# EasyEDA Pro project ProPrj_MiniFoc_AT32F403A.epro, board PCB
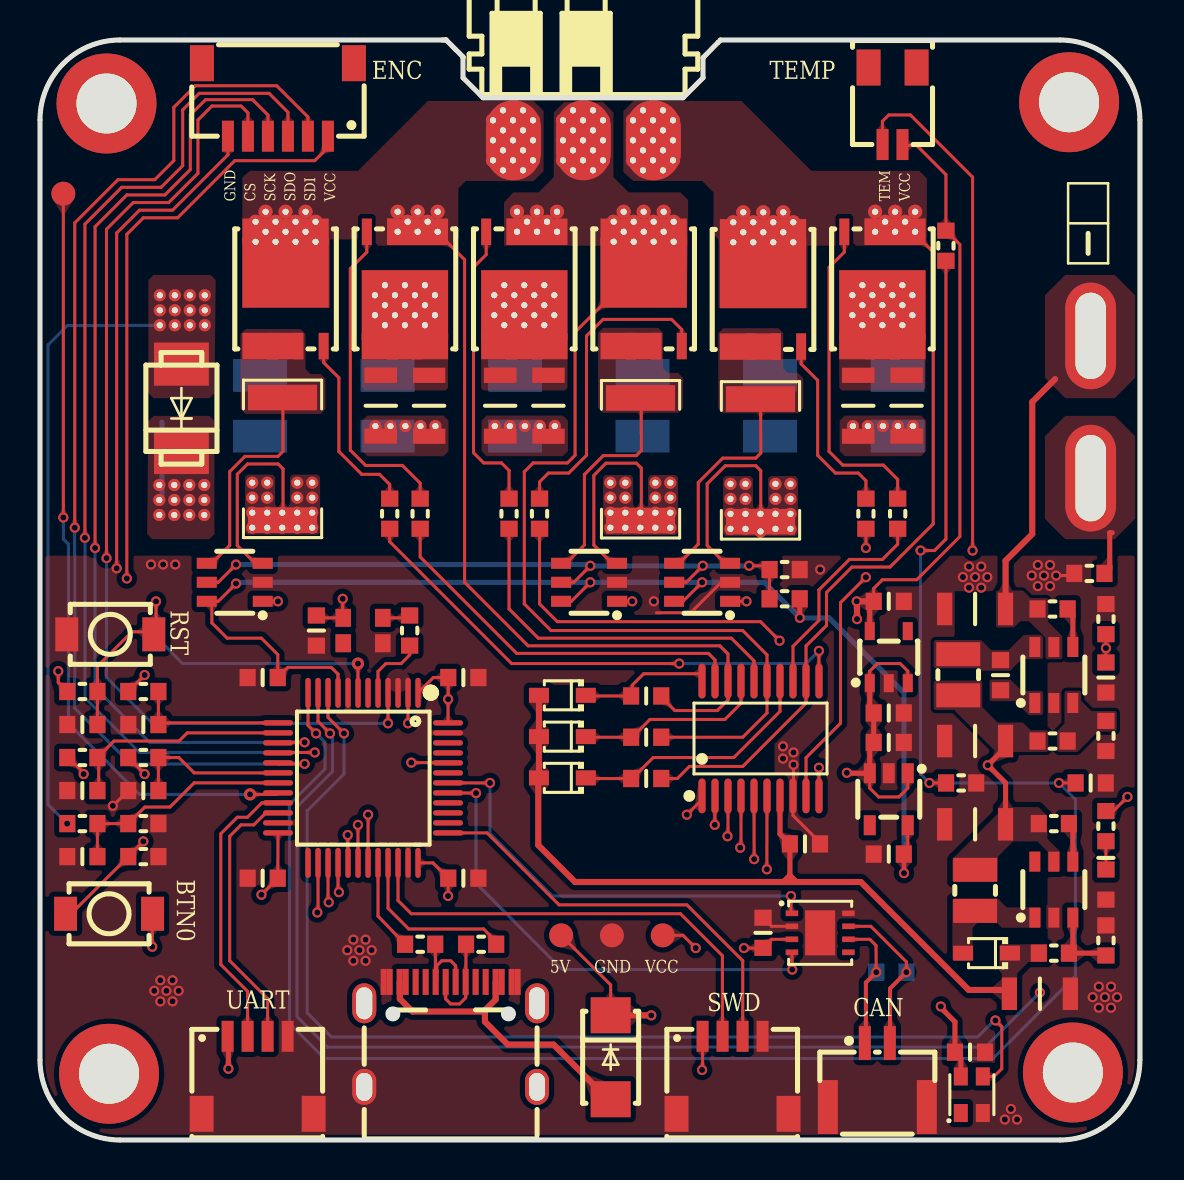
[diagram p3: board, top side]
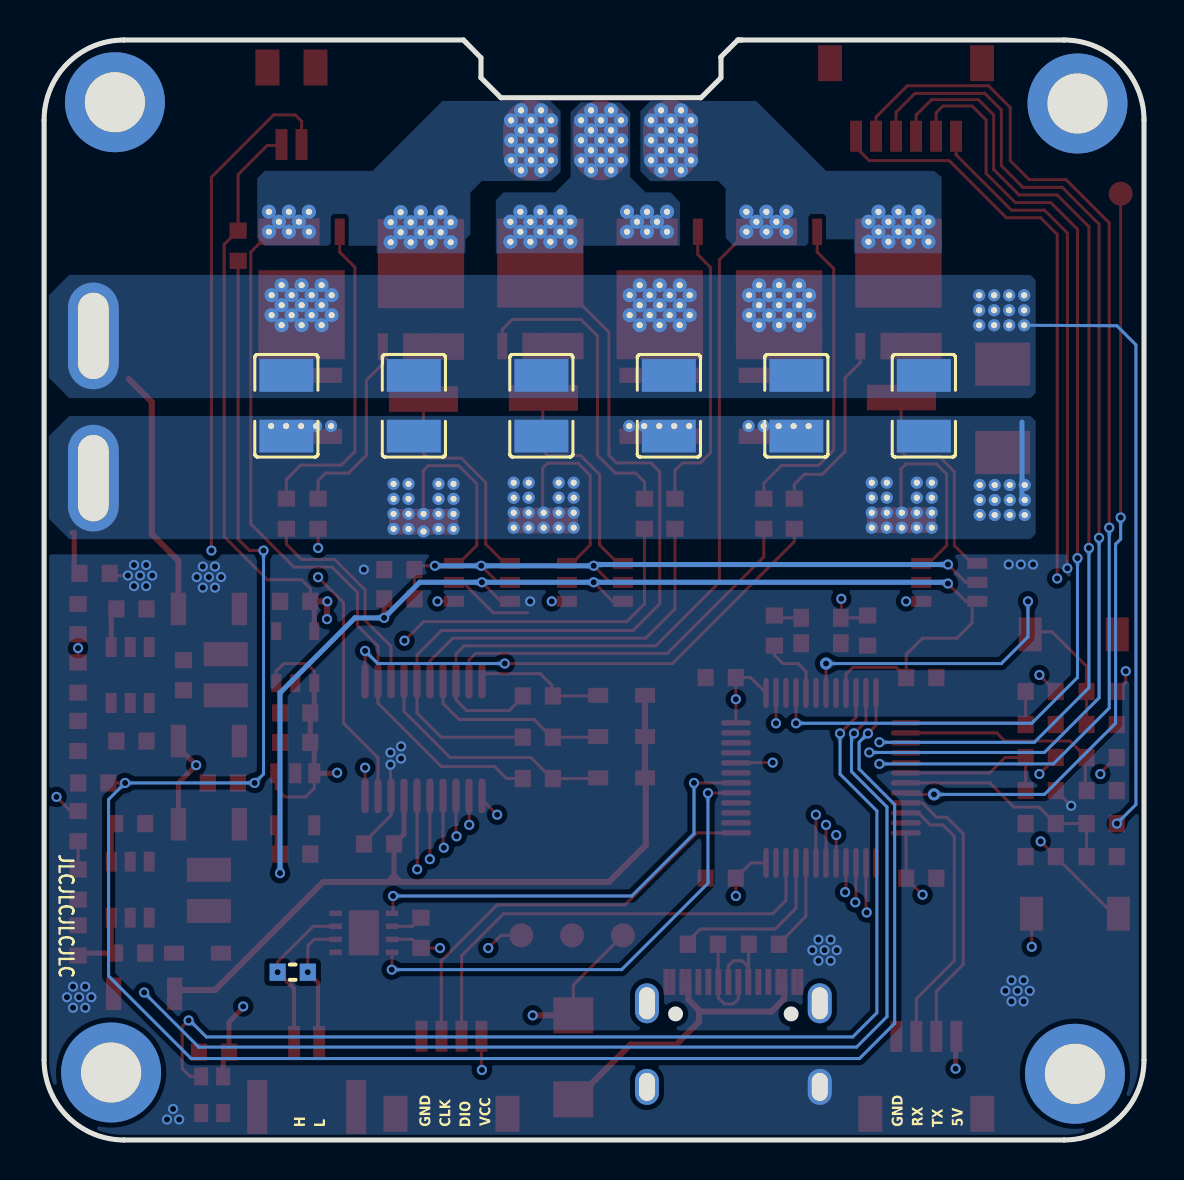
[diagram p4: board, bottom side, seen from below]

Outline 55 x 55 mm; copper layers: Top Layer, Inner1, Inner2, Bottom Layer. Coordinates in mm from the lower left corner of the outline.
Outline path: 20.31,55 4,55 arc(1.17,53.83) 0,51 0,4 arc(1.17,1.17) 4,0 51,0 arc(53.83,1.17) 55,4 55,51 arc(53.83,53.83) 51,55 34.03,55 33.9,54.88 33.16,54.11 33.16,53.11 32.15,52.11 22.15,52.11 21.15,53.11 21.15,54.15 20.31,55 ; 20.31,55 20.1,55
Stack: Top Layer 0.035mm / Dielectric1 0.48mm PP er 4.5 / Inner1 0.035mm / Dielectric2 0.48mm FR4 er 4.5 / Inner2 0.035mm / Dielectric3 0.48mm PP er 4.5 / Bottom Layer 0.035mm

## Design rules (mm)
spacing Default (default): track to track 0.114, other pairs 0 to 0.114
track width Default (default): min 0.152, default 0.152, max 25.4
differential pair differentialPair (default): width min 0.127, default 0.254, max 2.54; gap min 0.152, default 0.152
via Default (default): diameter min 0.508, default 0.508, max 100.025; hole min 0.305, default 0.305, max 59.995
net VCC uses gge95022
net GND uses gge532927
net DCBUS uses gge95022(2)
net 5V uses gge95022
net $1N272 uses gge95022
net $1N238 uses gge95022
net $1N239 uses gge95022
net VGS uses gge95022
net $1N13637 uses gge95022
pour e628 uses gge95022
pour e629 uses gge95022(1)
pour e630 uses gge95022(2)
pour e2292 uses gge95022

## Placement (name value [footprint] x y rotation side)
C1  100nF  [C0603_SMALL]  11.14 13.09 0 top
C2  10uF  [C0603_SMALL]  38.25 14.8 0 top
C3  1uF  [C0603_SMALL]  30.31 18.07 180 top
C4  22uF  [C1206_SMALL]  50 7.31 180 top
C5  22uF  [C1206_SMALL]  46.76 15.78 0 top
C6  100nF  [C0603_SMALL]  48.03 23.24 270 top
C7  2.2uF  [C0603_SMALL]  53.3 23.12 90 top
C8  10uF  [C1206_SMALL]  23.01 36.71 90 top
C9  1uF  [C0603_SMALL]  2.12 14.17 0 top
C10  100nF  [C0603_SMALL]  46.51 4.39 0 top
C11  1uF  [C0603_SMALL]  30.31 22.2 180 top
C12  1uF  [C0603_SMALL]  30.31 20.14 180 top
C13  100nF  [C0603_SMALL]  2.12 20.77 0 top
C14  100nF  [C0603_SMALL]  36.16 10.36 270 top
C17  100nF  [C0603_SMALL]  21.17 13.09 180 top
C18  100nF  [C0603_SMALL]  21.17 23.12 180 top
C19  100nF  [C0603_SMALL]  13.82 25.47 90 top
C20  47uF  [C1206_SMALL]  46.76 19.95 0 top
C21  10uF  [C1206_SMALL]  25.42 36.71 90 top
C22  1nF  [C0603_SMALL]  5.17 20.77 180 top
C23  1nF  [C0603_SMALL]  2.12 17.47 180 top
C24  1nF  [C0603_SMALL]  5.17 17.47 180 top
C25  10uF  [C1206_SMALL]  40.92 36.71 90 top
C26  10uF  [C1206_SMALL]  43.33 36.71 90 top
C27  4.7uF  [C1206_SMALL]  46.76 26.55 0 top
C28  10uF  [C1206_SMALL]  17.04 36.71 90 top
C29  10uF  [C1206_SMALL]  19.45 36.71 90 top
C30  1uF  [C0603_SMALL]  42.44 14.3 0 top
C31  1uF  [C0603_SMALL]  42.44 19.88 180 top
C32  100nF  [C0603_SMALL]  11.14 23.12 180 top
C46  2.2uF  [C0603_SMALL]  52.54 17.85 180 top
C89  10uF  [C0603_SMALL]  42.44 21.35 180 top
C90  10uF  [C0603_SMALL]  42.44 26.93 180 top
CN1  M1010RS-04P  [CONN-SMD_M1010RS-04P]  10.88 3.25 0 top
CN4  M1010RS-04P  [CONN-SMD_M1010RS-04P]  34.63 3.25 0 top
CN5  M1010RS-06P  [CONN-SMD_M1010RS-06P]  11.9 52.02 0 top
CN6  A1002WR-S-2P  [CONN-SMD_A1002WR-S-2P]  42.63 51.7 180 top
CN7  X1251WRS-02HF-LPSW  [CONN-SMD_2P-P1.25_X1251WRS-02HF-LPSW]  41.87 3.25 0 top
D1  SMBJ36CA  [SMB(DO-214AA)]  7.07 36.58 270 top
D2  1N5819WS  [SOD-323_L1.8-W1.3-LS2.5-RD]  26.12 20.17 180 top
D3  1N5819WS  [SOD-323_L1.8-W1.3-LS2.5-RD]  26.12 22.23 180 top
D4  SS34  [SMA_L4.4-W2.8-LS5.4-RD]  28.53 4.14 270 top
D5  1N5819WS  [SOD-323_L1.8-W1.3-LS2.5-RD]  26.12 18.11 180 top
D6  1N5819WS  [SOD-323_L1.8-W1.3-LS2.5-RD]  47.33 9.34 180 top
H1  -  [MR30-M]  27.18 49.98 0 top
L1  10uH  [IND-SMD_L2.5-W2.0]  46.76 12.48 90 top
L2  4.7uH  [IND-SMD_L2.5-W2.0]  45.92 23.26 90 top
LED2  NCD0603B1  [LED0603_RED_SMALL]  53.3 12.77 270 top
LED4  WS2812B-2020  [LED-SMD_4P-L2.0-W2.0-TL_WS2812B-2020]  46.6 2.26 90 top
MC1  22uF  [C1210]  42.89 36.71 90 bottom
MC2  22uF  [C1210]  36.51 36.71 90 bottom
MC3  22uF  [C1210]  30.13 36.71 90 bottom
MC4  22uF  [C1210]  11.01 36.71 90 bottom
MC5  22uF  [C1210]  17.38 36.71 90 bottom
MC6  22uF  [C1210]  23.76 36.71 90 bottom
NOREF  -  [Pad_e1771]  29.65 48.98 90 top
NOREF#2  -  [Pad_e1831]  3.33 51.83 180 top
NOREF#3  -  [Pad_e1722]  12.11 30.62 0 top
NOREF#4  -  [Pad_e1760]  36.78 32.81 0 top
NOREF#5  -  [Pad_e1729]  12.86 31.37 0 top
NOREF#6  -  [Pad_e1736]  28.52 31.37 0 top
NOREF#7  -  [Pad_e1724]  12.86 32.87 0 top
NOREF#8  -  [Pad_e1758]  36.03 30.43 0 top
NOREF#9  -  [Pad_e1739]  29.27 30.62 0 top
NOREF#10  -  [Pad_e1904]  31.19 45.41 0 top
NOREF#11  -  [Pad_e1816]  24.15 49.48 90 top
NOREF#12  -  [Pad_e1846]  41.62 41.24 0 top
NOREF#13  -  [Pad_e1795]  27.65 51.48 90 top
NOREF#14  -  [Pad_e1796]  28.15 50.98 90 top
NOREF#15  -  [Pad_e1726]  12.86 32.12 0 top
NOREF#16  -  [Pad_e1962]  5.99 41.49 180 top
NOREF#17  -  [Pad_e1756]  34.53 30.56 0 top
NOREF#18  -  [Pad_e1713]  52.54 33.09 0 top
NOREF#19  -  [Pad_e1898]  10.78 45.91 0 top
NOREF#20  -  [Pad_e1906]  31.19 46.41 0 top
NOREF#21  -  [Pad_e1734]  28.52 32.12 0 top
NOREF#22  -  [Pad_e1811]  23.65 50.98 90 top
NOREF#23  -  [Pad_e1950]  18.88 46.41 0 top
NOREF#24  -  [Pad_e1947]  18.38 45.91 0 top
NOREF#25  -  [Pad_e1723]  12.11 31.37 0 top
NOREF#26  -  [Pad_e1959]  6.74 40.74 180 top
NOREF#27  -  [Pad_e1818]  24.15 48.48 90 top
NOREF#28  -  [Pad_e1789]  26.15 48.98 90 top
NOREF#29  -  [Pad_e1822]  8.22 32.75 0 top
NOREF#30  -  [Pad_e1826]  5.97 32 0 top
NOREF#31  -  [Pad_e1937]  25.35 45.91 0 top
NOREF#32  -  [Pad_e1842]  42.12 41.74 0 top
NOREF#33  -  [Pad_e1924]  34.67 45.89 0 top
NOREF#34  -  [Pad_e1836]  43.62 42.24 0 top
NOREF#35  -  [Pad_e1839]  43.12 40.74 0 top
NOREF#36  -  [Pad_e1944]  19.88 45.41 0 top
NOREF#37  -  [Pad_e1804]  23.15 50.48 90 top
NOREF#38  -  [Pad_e1772]  30.15 48.48 90 top
NOREF#39  -  [Pad_e1983]  42.9 35.7 0 top
NOREF#40  -  [Pad_e1932]  41.76 45.41 0 top
NOREF#41  -  [Pad_e1979]  25.74 35.7 0 top
NOREF#42  -  [Pad_e1800]  28.15 48.98 90 top
NOREF#43  -  [Pad_e1871]  19.25 41.74 0 top
NOREF#44  -  [Pad_e1802]  23.15 51.48 90 top
NOREF#45  -  [Pad_e1862]  23.72 42.24 0 top
NOREF#46  -  [Pad_e1847]  41.12 40.74 0 top
NOREF#47  -  [Pad_e1860]  24.72 42.24 0 top
NOREF#48  -  [Pad_e1921]  35.67 44.89 0 top
NOREF#49  -  [Pad_e1764]  37.53 31.31 0 top
NOREF#50  -  [Pad_e1960]  6.74 41.49 180 top
NOREF#51  -  [Pad_e1887]  12.28 45.41 0 top
NOREF#52  -  [Pad_e1762]  36.78 32.06 0 top
NOREF#53  -  [Pad_e1918]  36.67 45.89 0 top
NOREF#54  -  [Pad_e1835]  43.12 42.74 0 top
NOREF#55  -  [Pad_e1725]  13.61 32.87 0 top
NOREF#56  -  [Pad_e1858]  24.22 40.74 0 top
NOREF#57  -  [Pad_e1883]  17.25 41.74 0 top
NOREF#58  -  [Pad_e1977]  24.24 35.7 0 top
NOREF#59  -  [Pad_e1856]  25.22 40.74 0 top
NOREF#60  -  [Pad_e1865]  22.72 41.24 0 top
NOREF#61  -  [Pad_e1917]  36.67 44.89 0 top
NOREF#62  -  [Pad_e1781]  31.65 49.98 90 top
NOREF#63  -  [Pad_e1896]  10.78 44.91 0 top
NOREF#64  -  [Pad_e1774]  30.15 50.48 90 top
NOREF#65  -  [Pad_e1894]  11.78 45.91 0 top
NOREF#66  -  [Pad_e1881]  17.25 40.74 0 top
NOREF#67  -  [Pad_e1840]  42.62 41.24 0 top
NOREF#68  -  [Pad_e1728]  13.61 31.37 0 top
NOREF#69  -  [Pad_e1759]  36.03 31.31 0 top
NOREF#70  -  [Pad_e1897]  11.28 45.41 0 top
NOREF#71  -  [Pad_e1926]  36.17 46.39 0 top
NOREF#72  -  [Pad_e1978]  24.99 35.7 0 top
NOREF#73  -  [Pad_e1940]  23.85 45.41 0 top
NOREF#74  -  [Pad_e1791]  26.65 48.48 90 top
NOREF#75  -  [Pad_e1735]  29.27 32.12 0 top
NOREF#76  -  [Pad_e1957]  7.49 40.74 180 top
NOREF#77  -  [Pad_e1984]  43.65 35.7 0 top
NOREF#78  -  [Pad_e1971]  17.52 35.7 0 top
NOREF#79  -  [Pad_e1909]  29.69 45.91 0 top
NOREF#80  -  [Pad_e1901]  30.69 44.91 0 top
NOREF#81  -  [Pad_e1877]  18.75 42.24 0 top
NOREF#82  -  [Pad_e1825]  6.72 32 0 top
NOREF#83  -  [Pad_e1785]  26.65 51.48 90 top
NOREF#84  -  [Pad_e1769]  29.65 50.98 90 top
NOREF#85  -  [Pad_e1820]  6.72 32.75 0 top
NOREF#86  -  [Pad_e1941]  23.85 46.41 0 top
NOREF#87  -  [Pad_e1845]  41.62 42.24 0 top
NOREF#88  -  [Pad_e1828]  6.72 31.25 0 top
NOREF#89  -  [Pad_e1880]  17.75 41.24 0 top
NOREF#90  -  [Pad_e1902]  29.69 44.91 0 top
NOREF#91  -  [Pad_e1838]  43.62 41.24 0 top
NOREF#92  -  [Pad_e1907]  30.69 45.91 0 top
NOREF#93  -  [Pad_e1905]  31.69 45.91 0 top
NOREF#94  -  [Pad_e1935]  43.76 46.41 0 top
NOREF#95  -  [Pad_e1766]  36.78 30.56 0 top
NOREF#96  -  [Pad_e1920]  35.67 45.89 0 top
NOREF#97  -  [Pad_e1888]  12.78 45.91 0 top
NOREF#98  -  [Pad_e1733]  29.27 32.87 0 top
NOREF#99  -  [Pad_e1973]  19.02 35.7 0 top
NOREF#100  -  [Pad_e1936]  25.85 45.41 0 top
NOREF#101  -  [Pad_e1908]  30.19 46.41 0 top
NOREF#102  -  [Pad_e1882]  16.75 41.24 0 top
NOREF#103  -  [Pad_e1916]  37.17 45.39 0 top
NOREF#104  -  [Pad_e1884]  16.75 42.24 0 top
NOREF#105  -  [Pad_e1793]  27.15 49.98 90 top
NOREF#106  -  [Pad_e1923]  35.17 45.39 0 top
NOREF#107  -  [Pad_e1869]  19.25 42.74 0 top
NOREF#108  -  [Pad_e1757]  35.28 30.56 0 top
NOREF#109  -  [Pad_e1827]  5.97 31.25 0 top
NOREF#110  -  [Pad_e1974]  19.77 35.7 0 top
NOREF#111  -  [Pad_e1803]  22.65 50.98 90 top
NOREF#112  -  [Pad_e1720]  10.61 30.62 0 top
NOREF#113  -  [Pad_e1761]  37.53 32.81 0 top
NOREF#114  -  [Pad_e1943]  25.85 46.41 0 top
NOREF#115  -  [Pad_e1850]  40.62 42.24 0 top
NOREF#116  -  [Pad_e1775]  30.65 50.98 90 top
NOREF#117  -  [Pad_e1779]  30.65 49.98 90 top
NOREF#118  -  [Pad_e1911]  28.69 44.91 0 top
NOREF#119  -  [Pad_e1810]  23.65 49.98 90 top
NOREF#120  -  [Pad_e1824]  7.47 32 0 top
NOREF#121  -  [Pad_e1930]  42.76 45.41 0 top
NOREF#122  -  [Pad_e1852]  25.22 42.74 0 top
NOREF#123  -  [Pad_e1813]  24.65 50.98 90 top
NOREF#124  -  [Pad_e1797]  27.65 50.48 90 top
NOREF#125  -  [Pad_e1891]  13.78 45.91 0 top
NOREF#126  -  [Pad_e1777]  31.65 50.98 90 top
NOREF#127  -  [Pad_e1814]  24.15 50.48 90 top
NOREF#128  -  [Pad_e1752]  34.53 32.06 0 top
NOREF#129  -  [Pad_e1750]  34.53 32.81 0 top
NOREF#130  -  [Pad_e1929]  43.26 45.91 0 top
NOREF#131  -  [Pad_e1821]  7.47 32.75 0 top
NOREF#132  -  [Pad_e1900]  31.69 44.91 0 top
NOREF#133  -  [Pad_e1837]  43.12 41.74 0 top
NOREF#134  -  [Pad_e1754]  34.53 31.31 0 top
NOREF#135  -  [Pad_e1819]  5.97 32.75 0 top
NOREF#136  -  [Pad_e1859]  24.22 41.74 0 top
NOREF#137  -  [Pad_e1854]  25.22 41.74 0 top
NOREF#138  -  [Pad_e1716]  10.61 32.12 0 top
NOREF#139  -  [Pad_e1861]  24.22 42.74 0 top
NOREF#140  -  [Pad_e1753]  35.28 32.06 0 top
NOREF#141  -  [Pad_e1878]  18.25 42.74 0 top
NOREF#142  -  [Pad_e1798]  28.15 49.98 90 top
NOREF#143  -  [Pad_e1915]  37.67 45.89 0 top
NOREF#144  -  [Pad_e1730]  12.86 30.62 0 top
NOREF#145  -  [Pad_e1876]  18.25 41.74 0 top
NOREF#146  -  [Pad_e1794]  27.15 50.98 90 top
NOREF#147  -  [Pad_e1954]  8.24 42.24 180 top
NOREF#148  -  [Pad_e1833]  3.45 3.31 180 top
NOREF#149  -  [Pad_e1922]  34.67 44.89 0 top
NOREF#150  -  [Pad_e1925]  35.17 46.39 0 top
NOREF#151  -  [Pad_e1767]  37.53 30.56 0 top
NOREF#152  -  [Pad_e1801]  27.65 48.48 90 top
NOREF#153  -  [Pad_e1829]  7.47 31.25 0 top
NOREF#154  -  [Pad_e1874]  18.75 41.24 0 top
NOREF#155  -  [Pad_e1857]  24.72 41.24 0 top
NOREF#156  -  [Pad_e1782]  31.65 48.98 90 top
NOREF#157  -  [Pad_e1747]  30.77 31.37 0 top
NOREF#158  -  [Pad_e1864]  23.22 40.74 0 top
NOREF#159  -  [Pad_e1863]  23.72 41.24 0 top
NOREF#160  -  [Pad_e1952]  6.74 42.24 180 top
NOREF#161  -  [Pad_e1745]  31.52 32.12 0 top
NOREF#162  -  [Pad_e1807]  23.15 49.48 90 top
NOREF#163  -  [Pad_e1834]  51.65 3.37 180 top
NOREF#164  -  [Pad_e1949]  17.88 46.41 0 top
NOREF#165  -  [Pad_e1955]  8.24 41.49 180 top
NOREF#166  -  [Pad_e1879]  17.75 42.24 0 top
NOREF#167  -  [Pad_e1815]  24.65 49.98 90 top
NOREF#168  -  [Pad_e1778]  31.15 50.48 90 top
NOREF#169  -  [Pad_e1799]  27.65 49.48 90 top
NOREF#170  -  [Pad_e1948]  17.88 45.41 0 top
NOREF#171  -  [Pad_e1742]  30.77 32.87 0 top
NOREF#172  -  [Pad_e1786]  26.15 50.98 90 top
NOREF#173  -  [Pad_e1776]  31.15 51.48 90 top
NOREF#174  -  [Pad_e1866]  23.22 41.74 0 top
NOREF#175  -  [Pad_e1946]  18.88 45.41 0 top
NOREF#176  -  [Pad_e1741]  30.02 31.37 0 top
NOREF#177  -  [Pad_e1912]  28.69 45.91 0 top
NOREF#178  -  [Pad_e1783]  31.15 48.48 90 top
NOREF#179  -  [Pad_e1749]  31.52 30.62 0 top
NOREF#180  -  [Pad_e1790]  26.65 49.48 90 top
NOREF#181  -  [Pad_e1727]  13.61 32.12 0 top
NOREF#182  -  [Pad_e1746]  31.52 31.37 0 top
NOREF#183  -  [Pad_e1958]  7.49 41.49 180 top
NOREF#184  -  [Pad_e1792]  27.15 48.98 90 top
NOREF#185  -  [Pad_e1843]  42.62 42.24 0 top
NOREF#186  -  [Pad_e1812]  24.15 51.48 90 top
NOREF#187  -  [Pad_e1867]  22.72 42.24 0 top
NOREF#188  -  [Pad_e1763]  37.53 32.06 0 top
NOREF#189  -  [Pad_e1942]  24.85 46.41 0 top
NOREF#190  -  [Pad_e1784]  30.65 48.98 90 top
NOREF#191  -  [Pad_e1953]  7.49 42.24 180 top
NOREF#192  -  [Pad_e1740]  30.02 30.62 0 top
NOREF#193  -  [Pad_e1945]  19.38 45.91 0 top
NOREF#194  -  [Pad_e1805]  22.65 49.98 90 top
NOREF#195  -  [Pad_e1961]  5.99 40.74 180 top
NOREF#196  -  [Pad_e1927]  37.17 46.39 0 top
NOREF#197  -  [Pad_e1890]  13.78 44.91 0 top
NOREF#198  -  [Pad_e1848]  40.62 41.24 0 top
NOREF#199  -  [Pad_e1773]  30.15 49.48 90 top
NOREF#200  -  [Pad_e1895]  11.78 44.91 0 top
NOREF#201  -  [Pad_e1934]  42.76 46.41 0 top
NOREF#202  -  [Pad_e1931]  42.26 45.91 0 top
NOREF#203  -  [Pad_e1982]  42.15 35.7 0 top
NOREF#204  -  [Pad_e1849]  41.12 41.74 0 top
NOREF#205  -  [Pad_e1913]  29.19 46.41 0 top
NOREF#206  -  [Pad_e1770]  29.65 49.98 90 top
NOREF#207  -  [Pad_e1980]  40.65 35.7 0 top
NOREF#208  -  [Pad_e1872]  19.75 41.24 0 top
NOREF#209  -  [Pad_e1933]  41.76 46.41 0 top
NOREF#210  -  [Pad_e1719]  11.36 31.37 0 top
NOREF#211  -  [Pad_e1981]  41.4 35.7 0 top
NOREF#212  -  [Pad_e1718]  10.61 31.37 0 top
NOREF#213  -  [Pad_e1744]  30.77 32.12 0 top
NOREF#214  -  [Pad_e1951]  19.88 46.41 0 top
NOREF#215  -  [Pad_e1873]  19.25 40.74 0 top
NOREF#216  -  [Pad_e1892]  13.28 46.41 0 top
NOREF#217  -  [Pad_e1851]  41.12 42.74 0 top
NOREF#218  -  [Pad_e1732]  28.52 32.87 0 top
NOREF#219  -  [Pad_e1868]  23.22 42.74 0 top
NOREF#220  -  [Pad_e1817]  24.65 48.98 90 top
NOREF#221  -  [Pad_e1886]  12.78 44.91 0 top
NOREF#222  -  [Pad_e1899]  11.28 46.41 0 top
NOREF#223  -  [Pad_e1808]  23.15 48.48 90 top
NOREF#224  -  [Pad_e1844]  42.12 42.74 0 top
NOREF#225  -  [Pad_e1755]  35.28 31.31 0 top
NOREF#226  -  [Pad_e1823]  8.22 32 0 top
NOREF#227  -  [Pad_e1788]  26.15 49.98 90 top
NOREF#228  -  [Pad_e1721]  11.36 30.62 0 top
NOREF#229  -  [Pad_e1806]  22.65 48.98 90 top
NOREF#230  -  [Pad_e1765]  36.78 31.31 0 top
NOREF#231  -  [Pad_e1748]  30.77 30.62 0 top
NOREF#232  -  [Pad_e1885]  17.25 42.74 0 top
NOREF#233  -  [Pad_e1717]  11.36 32.12 0 top
NOREF#234  -  [Pad_e1743]  31.52 32.87 0 top
NOREF#235  -  [Pad_e1914]  37.67 44.89 0 top
NOREF#236  -  [Pad_e1889]  13.28 45.41 0 top
NOREF#237  -  [Pad_e1738]  28.52 30.62 0 top
NOREF#238  -  [Pad_e1714]  10.61 32.87 0 top
NOREF#239  -  [Pad_e1919]  36.17 45.39 0 top
NOREF#240  -  [Pad_e1780]  31.15 49.48 90 top
NOREF#241  -  [Pad_e1809]  23.65 48.98 90 top
NOREF#242  -  [Pad_e1870]  19.75 42.24 0 top
NOREF#243  -  [Pad_e1976]  23.49 35.7 0 top
NOREF#244  -  [Pad_e1715]  11.36 32.87 0 top
NOREF#245  -  [Pad_e1991]  52.54 40.2 0 top
NOREF#246  -  [Pad_e1972]  18.27 35.7 0 top
NOREF#247  -  [Pad_e1737]  29.27 31.37 0 top
NOREF#248  -  [Pad_e1855]  25.72 41.24 0 top
NOREF#249  -  [Pad_e1830]  8.22 31.25 0 top
NOREF#250  -  [Pad_e1970]  16.77 35.7 0 top
NOREF#251  -  [Pad_e1731]  13.61 30.62 0 top
NOREF#252  -  [Pad_e1841]  42.12 40.74 0 top
NOREF#253  -  [Pad_e1832]  51.46 51.89 180 top
NOREF#254  -  [Pad_e1939]  24.35 45.91 0 top
NOREF#255  -  [Pad_e1875]  18.25 40.74 0 top
NOREF#256  -  [Pad_e1903]  30.19 45.41 0 top
NOREF#257  -  [Pad_e1910]  29.19 45.41 0 top
NOREF#258  -  [Pad_e1893]  12.28 46.41 0 top
NOREF#259  -  [Pad_e1928]  43.76 45.41 0 top
NOREF#260  -  [Pad_e1975]  22.74 35.7 0 top
NOREF#261  -  [Pad_e1853]  25.72 42.24 0 top
NOREF#262  -  [Pad_e1938]  24.85 45.41 0 top
NOREF#263  -  [Pad_e1768]  30.15 51.48 90 top
NOREF#264  -  [Pad_e1751]  35.28 32.81 0 top
NOREF#265  -  [Pad_e1963]  5.99 42.24 180 top
NOREF#266  -  [Pad_e1787]  26.65 50.48 90 top
NOREF#267  -  [Pad_e1956]  8.24 40.74 180 top
Q7  KNY3406C  [PDFNWB-8L_L6.0-W5.0-P1.27-BL-EP_CON]  42.12 42.55 180 top
Q8  KNY3406C  [PDFNWB-8L_L6.0-W5.0-P1.27-BL-EP_CON]  24.22 42.55 180 top
Q9  KNY3406C  [PDFNWB-8L_L6.0-W5.0-P1.27-BL-EP_CON]  18.25 42.55 180 top
Q10  KNY3406C  [PDFNWB-8L_L6.0-W5.0-P1.27-BL-EP_CON]  36.16 42.53 0 top
Q11  KNY3406C  [PDFNWB-8L_L6.0-W5.0-P1.27-BL-EP_CON]  30.19 42.55 0 top
Q12  KNY3406C  [PDFNWB-8L_L6.0-W5.0-P1.27-BL-EP_CON]  12.28 42.55 0 top
R1  10kΩ  [R0603_SMALL]  2.12 15.82 0 top
R2  5mΩ  [R2512]  12.13 34.06 90 top
R3  5mΩ  [R2512]  30.03 34.04 90 top
R4  10kΩ  [R0603_SMALL]  2.12 22.42 0 top
R5  100kΩ  [R0603_SMALL]  50.7 9.34 0 top
R6  1kΩ  [R0603_SMALL]  53.3 15.69 270 top
R7  2.2Ω  [R0603_SMALL]  42.89 31.31 90 top
R8  1kΩ  [R0603_SMALL]  5.17 15.82 0 top
R9  120Ω  [R0603_SMALL]  42.57 8.39 180 bottom
R10  10kΩ  [R0603_SMALL]  5.17 14.17 0 top
R11  2.2Ω  [R0603_SMALL]  41.3 31.31 90 top
R12  22Ω  [R0603_SMALL]  18.48 25.47 90 top
R13  3.3kΩ  [R0603_SMALL]  46.06 17.85 0 top
R14  5mΩ  [R2512]  36.03 33.98 90 top
R15  3.3kΩ  [R0603_SMALL]  53.3 26.04 90 top
R16  22Ω  [R0603_SMALL]  5.17 22.42 180 top
R17  22Ω  [R0603_SMALL]  2.12 19.12 180 top
R18  22Ω  [R0603_SMALL]  5.17 19.12 180 top
R19  2.2Ω  [R0603_SMALL]  23.46 31.31 90 top
R20  1kΩ  [R0603_SMALL]  37.23 28.52 0 top
R21  1kΩ  [R0603_SMALL]  37.23 27.06 180 top
R22  2.2Ω  [R0603_SMALL]  24.98 31.31 90 top
R23  2.2Ω  [R0603_SMALL]  19.01 31.31 90 top
R24  2.2Ω  [R0603_SMALL]  17.49 31.31 90 top
R25  5.1kΩ  [R0603_SMALL]  53.3 9.98 90 top
R26  10kΩ  [R0603_SMALL]  53.3 20.2 270 top
R27  52.3kΩ  [R0603_SMALL]  50.63 19.95 0 top
R28  10kΩ  [R0603_SMALL]  50.7 15.82 0 top
R29  10kΩ  [R0603_SMALL]  50.63 26.55 0 top
R61  0Ω  [R0603_SMALL]  52.47 28.33 180 top
R62  22Ω  [R0603_SMALL]  22.06 9.79 180 top
R63  22Ω  [R0603_SMALL]  19.01 9.79 0 top
RT1  TCTR0603F10K0F3930T  [R0603_SMALL]  45.3 44.71 90 top
SW1  ST-1185S  [SW-SMD_ST-1185S]  3.52 25.28 0 top
SW2  ST-1185S  [SW-SMD_ST-1185S]  3.45 11.31 0 top
TP1  Testpoint 1.6mm  [TESTPOINT 1.6MM]  31.14 10.23 0 top
TP2  Testpoint 1.6mm  [TESTPOINT 1.6MM]  26.06 10.23 0 top
TP3  Testpoint 1.6mm  [TESTPOINT 1.6MM]  28.6 10.23 0 top
TP4  Testpoint 1.6mm  [TESTPOINT 1.6MM]  1.17 47.32 0 top
U1  FD6288T  [TSSOP-20_L6.5-W4.4-P0.65-LS6.4-BL]  36.03 20.08 0 top
U2  RY8411  [SOT-23-6_L2.9-W1.6-P0.95-LS2.8-BR]  50.7 23.25 270 top
U3  AT32F403ACGT7  [LQFP-48_L7.0-W7.0-P0.50-LS9.0-BL]  16.15 18.11 180 top
U4  INA181A2IDBVT  [SOT-23-6_L2.9-W1.6-P0.95-LS2.8-BR]  33.11 27.89 0 top
U6  SIT3051TK  [DFN-8_L3.0-W3.0-P0.65-BL-EP]  39.01 10.36 270 top
U7  XC6210B332MR  [SOT-25_L3.0-W1.6-P0.95-LS2.8-BL]  42.44 24.14 0 top
U8  INA181A2IDBVT  [SOT-23-6_L2.9-W1.6-P0.95-LS2.8-BR]  27.46 27.89 0 top
U9  INA181A2IDBVT  [SOT-23-6_L2.9-W1.6-P0.95-LS2.8-BR]  9.74 27.89 0 top
U13  LP5907MFX-3.3/NOPB  [SOT-23-5_L3.0-W1.7-P0.95-LS2.8-BR]  42.44 17.04 90 top
U14  MT3608  [SOT-23-6_L2.9-W1.6-P0.95-LS2.8-BR]  50.7 12.52 270 top
USBC1  TYPE-C-31-M-12  [USB-C_SMD-TYPE-C-31-M-12]  20.53 5.28 0 top
X1  8MHz  [OSC-SMD_4P-L2.5-W2.0-BL_DSB321SDA]  16.15 25.47 0 top

## Footprints (pads in the part's own frame, mm; a bottom-side part is the same pattern mirrored in y, then rotated)
C0603_SMALL
  rect 0.806x0.864 smd: 1(-0.753,0) 2(0.753,0)
C1206_SMALL
  rect 0.762x1.625 smd: 1(-1.524,0) 2(1.524,0)
C1210
  rect 1.635x2.7 smd: 1(-1.518,0) 2(1.518,0)
CONN-SMD_2P-P1.25_X1251WRS-02HF-LPSW
  rect 0.6x1.7 smd: 1(-0.625,1.6) 2(0.625,1.6)
  rect 1x2.7 smd: 3(2.475,-1.6) 4(-2.475,-1.6)
CONN-SMD_A1002WR-S-2P
  rect 0.6x1.55 smd: 1(-0.498,1.925) 2(0.5,1.925)
  rect 1.199x1.801 smd: 3(1.202,-1.925) 4(-1.202,-1.925)
CONN-SMD_M1010RS-04P
  rect 0.6x1.55 smd: 1(-1.5,1.938) 2(-0.5,1.938) 3(0.5,1.938) 4(1.5,1.938)
  rect 1.2x1.8 smd: 5(2.8,-1.938) 6(-2.8,-1.938)
CONN-SMD_M1010RS-06P
  rect 1.2x1.8 smd: 0(3.8,1.825) 7(-3.8,1.825)
  rect 0.6x1.55 smd: 1(2.5,-1.825) 2(1.5,-1.825) 3(0.5,-1.825) 4(-0.5,-1.825) 5(-1.5,-1.825) 6(-2.5,-1.825)
DFN-8_L3.0-W3.0-P0.65-BL-EP
  rect 0.28x0.625 smd: 1(-0.976,-1.412) 2(-0.325,-1.412) 3(0.325,-1.412) 4(0.976,-1.412) 5(0.976,1.412) 6(0.325,1.412) 7(-0.325,1.412) 8(-0.976,1.412)
  rect 2.251x1.501 smd: 9(0,0)
IND-SMD_L2.5-W2.0
  rect 1.199x2.2 smd: 1(1.028,0) 2(-1.028,0)
LED0603_RED_SMALL
  rect 0.806x0.864 smd: 1(0.753,0) 2(-0.753,0)
LED-SMD_4P-L2.0-W2.0-TL_WS2812B-2020
  rect 0.9x0.7 smd: 1(-0.915,0.55) 2(-0.915,-0.55) 3(0.915,-0.55) 4(0.915,0.55)
LQFP-48_L7.0-W7.0-P0.50-LS9.0-BL
  oval 0.27x1.5 smd: 1(-2.75,-4.25) 2(-2.25,-4.25) 3(-1.75,-4.25) 4(-1.25,-4.25) 5(-0.75,-4.25) 6(-0.25,-4.25) 7(0.25,-4.25) 8(0.75,-4.25) 9(1.25,-4.25) 10(1.75,-4.25) 11(2.25,-4.25) 12(2.75,-4.25) 25(2.75,4.25) 26(2.25,4.25) 27(1.75,4.25) 28(1.25,4.25) 29(0.75,4.25) 30(0.25,4.25) 31(-0.25,4.25) 32(-0.75,4.25) 33(-1.25,4.25) 34(-1.75,4.25) 35(-2.25,4.25) 36(-2.75,4.25)
  oval 1.5x0.27 smd: 13(4.25,-2.75) 14(4.25,-2.25) 15(4.25,-1.75) 16(4.25,-1.25) 17(4.25,-0.75) 18(4.25,-0.25) 19(4.25,0.25) 20(4.25,0.75) 21(4.25,1.25) 22(4.25,1.75) 23(4.25,2.25) 24(4.25,2.75) 37(-4.25,2.75) 38(-4.25,2.25) 39(-4.25,1.75) 40(-4.25,1.25) 41(-4.25,0.75) 42(-4.25,0.25) 43(-4.25,-0.25) 44(-4.25,-0.75) 45(-4.25,-1.25) 46(-4.25,-1.75) 47(-4.25,-2.25) 48(-4.25,-2.75)
MR30-M
  oval 2.75x4 smd: 1(-3.5,0) 2(0,0) 3(3.5,0)
OSC-SMD_4P-L2.5-W2.0-BL_DSB321SDA
  rect 0.78x0.9 smd: 1(-0.99,-0.635) 2(0.99,-0.635) 3(0.99,0.635) 4(-0.99,0.635)
Pad_e1713
  oval 2.54x5.334 hole 1.524x4.318: 2(0,0)
Pad_e1714
  round 0.61 hole 0.31x0.305: (0,0)
Pad_e1715
  round 0.61 hole 0.31x0.305: (0,0)
Pad_e1716
  round 0.61 hole 0.31x0.305: (0,0)
Pad_e1717
  round 0.61 hole 0.31x0.305: (0,0)
Pad_e1718
  round 0.61 hole 0.31x0.305: (0,0)
Pad_e1719
  round 0.61 hole 0.31x0.305: (0,0)
Pad_e1720
  round 0.61 hole 0.31x0.305: (0,0)
Pad_e1721
  round 0.61 hole 0.31x0.305: (0,0)
Pad_e1722
  round 0.61 hole 0.31x0.305: (0,0)
Pad_e1723
  round 0.61 hole 0.31x0.305: (0,0)
Pad_e1724
  round 0.61 hole 0.31x0.305: (0,0)
Pad_e1725
  round 0.61 hole 0.31x0.305: (0,0)
Pad_e1726
  round 0.61 hole 0.31x0.305: (0,0)
Pad_e1727
  round 0.61 hole 0.31x0.305: (0,0)
Pad_e1728
  round 0.61 hole 0.31x0.305: (0,0)
Pad_e1729
  round 0.61 hole 0.31x0.305: (0,0)
Pad_e1730
  round 0.61 hole 0.31x0.305: (0,0)
Pad_e1731
  round 0.61 hole 0.31x0.305: (0,0)
Pad_e1732
  round 0.61 hole 0.31x0.305: (0,0)
Pad_e1733
  round 0.61 hole 0.31x0.305: (0,0)
Pad_e1734
  round 0.61 hole 0.31x0.305: (0,0)
Pad_e1735
  round 0.61 hole 0.31x0.305: (0,0)
Pad_e1736
  round 0.61 hole 0.31x0.305: (0,0)
Pad_e1737
  round 0.61 hole 0.31x0.305: (0,0)
Pad_e1738
  round 0.61 hole 0.31x0.305: (0,0)
Pad_e1739
  round 0.61 hole 0.31x0.305: (0,0)
Pad_e1740
  round 0.61 hole 0.31x0.305: (0,0)
Pad_e1741
  round 0.61 hole 0.31x0.305: (0,0)
Pad_e1742
  round 0.61 hole 0.31x0.305: (0,0)
Pad_e1743
  round 0.61 hole 0.31x0.305: (0,0)
Pad_e1744
  round 0.61 hole 0.31x0.305: (0,0)
Pad_e1745
  round 0.61 hole 0.31x0.305: (0,0)
Pad_e1746
  round 0.61 hole 0.31x0.305: (0,0)
Pad_e1747
  round 0.61 hole 0.31x0.305: (0,0)
Pad_e1748
  round 0.61 hole 0.31x0.305: (0,0)
Pad_e1749
  round 0.61 hole 0.31x0.305: (0,0)
Pad_e1750
  round 0.61 hole 0.31x0.305: (0,0)
Pad_e1751
  round 0.61 hole 0.31x0.305: (0,0)
Pad_e1752
  round 0.61 hole 0.31x0.305: (0,0)
Pad_e1753
  round 0.61 hole 0.31x0.305: (0,0)
Pad_e1754
  round 0.61 hole 0.31x0.305: (0,0)
Pad_e1755
  round 0.61 hole 0.31x0.305: (0,0)
Pad_e1756
  round 0.61 hole 0.31x0.305: (0,0)
Pad_e1757
  round 0.61 hole 0.31x0.305: (0,0)
Pad_e1758
  round 0.61 hole 0.31x0.305: (0,0)
Pad_e1759
  round 0.61 hole 0.31x0.305: (0,0)
Pad_e1760
  round 0.61 hole 0.31x0.305: (0,0)
Pad_e1761
  round 0.61 hole 0.31x0.305: (0,0)
Pad_e1762
  round 0.61 hole 0.31x0.305: (0,0)
Pad_e1763
  round 0.61 hole 0.31x0.305: (0,0)
Pad_e1764
  round 0.61 hole 0.31x0.305: (0,0)
Pad_e1765
  round 0.61 hole 0.31x0.305: (0,0)
Pad_e1766
  round 0.61 hole 0.31x0.305: (0,0)
Pad_e1767
  round 0.61 hole 0.31x0.305: (0,0)
Pad_e1768
  round 0.711 hole 0.31x0.305: (0,0)
Pad_e1769
  round 0.711 hole 0.31x0.305: (0,0)
Pad_e1770
  round 0.711 hole 0.31x0.305: (0,0)
Pad_e1771
  round 0.711 hole 0.31x0.305: (0,0)
Pad_e1772
  round 0.711 hole 0.31x0.305: (0,0)
Pad_e1773
  round 0.711 hole 0.31x0.305: (0,0)
Pad_e1774
  round 0.711 hole 0.31x0.305: (0,0)
Pad_e1775
  round 0.711 hole 0.31x0.305: (0,0)
Pad_e1776
  round 0.711 hole 0.31x0.305: (0,0)
Pad_e1777
  round 0.711 hole 0.31x0.305: (0,0)
Pad_e1778
  round 0.711 hole 0.31x0.305: (0,0)
Pad_e1779
  round 0.711 hole 0.31x0.305: (0,0)
Pad_e1780
  round 0.711 hole 0.31x0.305: (0,0)
Pad_e1781
  round 0.711 hole 0.31x0.305: (0,0)
Pad_e1782
  round 0.711 hole 0.31x0.305: (0,0)
Pad_e1783
  round 0.711 hole 0.31x0.305: (0,0)
Pad_e1784
  round 0.711 hole 0.31x0.305: (0,0)
Pad_e1785
  round 0.711 hole 0.31x0.305: (0,0)
Pad_e1786
  round 0.711 hole 0.31x0.305: (0,0)
Pad_e1787
  round 0.711 hole 0.31x0.305: (0,0)
Pad_e1788
  round 0.711 hole 0.31x0.305: (0,0)
Pad_e1789
  round 0.711 hole 0.31x0.305: (0,0)
Pad_e1790
  round 0.711 hole 0.31x0.305: (0,0)
Pad_e1791
  round 0.711 hole 0.31x0.305: (0,0)
Pad_e1792
  round 0.711 hole 0.31x0.305: (0,0)
Pad_e1793
  round 0.711 hole 0.31x0.305: (0,0)
Pad_e1794
  round 0.711 hole 0.31x0.305: (0,0)
Pad_e1795
  round 0.711 hole 0.31x0.305: (0,0)
Pad_e1796
  round 0.711 hole 0.31x0.305: (0,0)
Pad_e1797
  round 0.711 hole 0.31x0.305: (0,0)
Pad_e1798
  round 0.711 hole 0.31x0.305: (0,0)
Pad_e1799
  round 0.711 hole 0.31x0.305: (0,0)
Pad_e1800
  round 0.711 hole 0.31x0.305: (0,0)
Pad_e1801
  round 0.711 hole 0.31x0.305: (0,0)
Pad_e1802
  round 0.711 hole 0.31x0.305: (0,0)
Pad_e1803
  round 0.711 hole 0.31x0.305: (0,0)
Pad_e1804
  round 0.711 hole 0.31x0.305: (0,0)
Pad_e1805
  round 0.711 hole 0.31x0.305: (0,0)
Pad_e1806
  round 0.711 hole 0.31x0.305: (0,0)
Pad_e1807
  round 0.711 hole 0.31x0.305: (0,0)
Pad_e1808
  round 0.711 hole 0.31x0.305: (0,0)
Pad_e1809
  round 0.711 hole 0.31x0.305: (0,0)
Pad_e1810
  round 0.711 hole 0.31x0.305: (0,0)
Pad_e1811
  round 0.711 hole 0.31x0.305: (0,0)
Pad_e1812
  round 0.711 hole 0.31x0.305: (0,0)
Pad_e1813
  round 0.711 hole 0.31x0.305: (0,0)
Pad_e1814
  round 0.711 hole 0.31x0.305: (0,0)
Pad_e1815
  round 0.711 hole 0.31x0.305: (0,0)
Pad_e1816
  round 0.711 hole 0.31x0.305: (0,0)
Pad_e1817
  round 0.711 hole 0.31x0.305: (0,0)
Pad_e1818
  round 0.711 hole 0.31x0.305: (0,0)
Pad_e1819
  round 0.61 hole 0.31x0.305: (0,0)
Pad_e1820
  round 0.61 hole 0.31x0.305: (0,0)
Pad_e1821
  round 0.61 hole 0.31x0.305: (0,0)
Pad_e1822
  round 0.61 hole 0.31x0.305: (0,0)
Pad_e1823
  round 0.61 hole 0.31x0.305: (0,0)
Pad_e1824
  round 0.61 hole 0.31x0.305: (0,0)
Pad_e1825
  round 0.61 hole 0.31x0.305: (0,0)
Pad_e1826
  round 0.61 hole 0.31x0.305: (0,0)
Pad_e1827
  round 0.61 hole 0.31x0.305: (0,0)
Pad_e1828
  round 0.61 hole 0.31x0.305: (0,0)
Pad_e1829
  round 0.61 hole 0.31x0.305: (0,0)
Pad_e1830
  round 0.61 hole 0.31x0.305: (0,0)
Pad_e1831
  round 5 hole 3.005x3: 1(0,0)
Pad_e1832
  round 5 hole 3.005x3: 1(0,0)
Pad_e1833
  round 5 hole 3.005x3: 1(0,0)
Pad_e1834
  round 5 hole 3.005x3: 1(0,0)
Pad_e1835
  round 0.711 hole 0.31x0.305: (0,0)
Pad_e1836
  round 0.711 hole 0.31x0.305: (0,0)
Pad_e1837
  round 0.711 hole 0.31x0.305: (0,0)
Pad_e1838
  round 0.711 hole 0.31x0.305: (0,0)
Pad_e1839
  round 0.711 hole 0.31x0.305: (0,0)
Pad_e1840
  round 0.711 hole 0.31x0.305: (0,0)
Pad_e1841
  round 0.711 hole 0.31x0.305: (0,0)
Pad_e1842
  round 0.711 hole 0.31x0.305: (0,0)
Pad_e1843
  round 0.711 hole 0.31x0.305: (0,0)
Pad_e1844
  round 0.711 hole 0.31x0.305: (0,0)
Pad_e1845
  round 0.711 hole 0.31x0.305: (0,0)
Pad_e1846
  round 0.711 hole 0.31x0.305: (0,0)
Pad_e1847
  round 0.711 hole 0.31x0.305: (0,0)
Pad_e1848
  round 0.711 hole 0.31x0.305: (0,0)
Pad_e1849
  round 0.711 hole 0.31x0.305: (0,0)
Pad_e1850
  round 0.711 hole 0.31x0.305: (0,0)
Pad_e1851
  round 0.711 hole 0.31x0.305: (0,0)
Pad_e1852
  round 0.711 hole 0.31x0.305: (0,0)
Pad_e1853
  round 0.711 hole 0.31x0.305: (0,0)
Pad_e1854
  round 0.711 hole 0.31x0.305: (0,0)
Pad_e1855
  round 0.711 hole 0.31x0.305: (0,0)
Pad_e1856
  round 0.711 hole 0.31x0.305: (0,0)
Pad_e1857
  round 0.711 hole 0.31x0.305: (0,0)
Pad_e1858
  round 0.711 hole 0.31x0.305: (0,0)
Pad_e1859
  round 0.711 hole 0.31x0.305: (0,0)
Pad_e1860
  round 0.711 hole 0.31x0.305: (0,0)
Pad_e1861
  round 0.711 hole 0.31x0.305: (0,0)
Pad_e1862
  round 0.711 hole 0.31x0.305: (0,0)
Pad_e1863
  round 0.711 hole 0.31x0.305: (0,0)
Pad_e1864
  round 0.711 hole 0.31x0.305: (0,0)
Pad_e1865
  round 0.711 hole 0.31x0.305: (0,0)
Pad_e1866
  round 0.711 hole 0.31x0.305: (0,0)
Pad_e1867
  round 0.711 hole 0.31x0.305: (0,0)
Pad_e1868
  round 0.711 hole 0.31x0.305: (0,0)
Pad_e1869
  round 0.711 hole 0.31x0.305: (0,0)
Pad_e1870
  round 0.711 hole 0.31x0.305: (0,0)
Pad_e1871
  round 0.711 hole 0.31x0.305: (0,0)
Pad_e1872
  round 0.711 hole 0.31x0.305: (0,0)
Pad_e1873
  round 0.711 hole 0.31x0.305: (0,0)
Pad_e1874
  round 0.711 hole 0.31x0.305: (0,0)
Pad_e1875
  round 0.711 hole 0.31x0.305: (0,0)
Pad_e1876
  round 0.711 hole 0.31x0.305: (0,0)
Pad_e1877
  round 0.711 hole 0.31x0.305: (0,0)
Pad_e1878
  round 0.711 hole 0.31x0.305: (0,0)
Pad_e1879
  round 0.711 hole 0.31x0.305: (0,0)
Pad_e1880
  round 0.711 hole 0.31x0.305: (0,0)
Pad_e1881
  round 0.711 hole 0.31x0.305: (0,0)
Pad_e1882
  round 0.711 hole 0.31x0.305: (0,0)
Pad_e1883
  round 0.711 hole 0.31x0.305: (0,0)
Pad_e1884
  round 0.711 hole 0.31x0.305: (0,0)
Pad_e1885
  round 0.711 hole 0.31x0.305: (0,0)
Pad_e1886
  round 0.711 hole 0.31x0.305: (0,0)
Pad_e1887
  round 0.711 hole 0.31x0.305: (0,0)
Pad_e1888
  round 0.711 hole 0.31x0.305: (0,0)
Pad_e1889
  round 0.711 hole 0.31x0.305: (0,0)
Pad_e1890
  round 0.711 hole 0.31x0.305: (0,0)
Pad_e1891
  round 0.711 hole 0.31x0.305: (0,0)
Pad_e1892
  round 0.711 hole 0.31x0.305: (0,0)
Pad_e1893
  round 0.711 hole 0.31x0.305: (0,0)
Pad_e1894
  round 0.711 hole 0.31x0.305: (0,0)
Pad_e1895
  round 0.711 hole 0.31x0.305: (0,0)
Pad_e1896
  round 0.711 hole 0.31x0.305: (0,0)
Pad_e1897
  round 0.711 hole 0.31x0.305: (0,0)
Pad_e1898
  round 0.711 hole 0.31x0.305: (0,0)
Pad_e1899
  round 0.711 hole 0.31x0.305: (0,0)
Pad_e1900
  round 0.711 hole 0.31x0.305: (0,0)
Pad_e1901
  round 0.711 hole 0.31x0.305: (0,0)
Pad_e1902
  round 0.711 hole 0.31x0.305: (0,0)
Pad_e1903
  round 0.711 hole 0.31x0.305: (0,0)
Pad_e1904
  round 0.711 hole 0.31x0.305: (0,0)
Pad_e1905
  round 0.711 hole 0.31x0.305: (0,0)
Pad_e1906
  round 0.711 hole 0.31x0.305: (0,0)
Pad_e1907
  round 0.711 hole 0.31x0.305: (0,0)
Pad_e1908
  round 0.711 hole 0.31x0.305: (0,0)
Pad_e1909
  round 0.711 hole 0.31x0.305: (0,0)
Pad_e1910
  round 0.711 hole 0.31x0.305: (0,0)
Pad_e1911
  round 0.711 hole 0.31x0.305: (0,0)
Pad_e1912
  round 0.711 hole 0.31x0.305: (0,0)
Pad_e1913
  round 0.711 hole 0.31x0.305: (0,0)
Pad_e1914
  round 0.711 hole 0.31x0.305: (0,0)
Pad_e1915
  round 0.711 hole 0.31x0.305: (0,0)
Pad_e1916
  round 0.711 hole 0.31x0.305: (0,0)
Pad_e1917
  round 0.711 hole 0.31x0.305: (0,0)
Pad_e1918
  round 0.711 hole 0.31x0.305: (0,0)
Pad_e1919
  round 0.711 hole 0.31x0.305: (0,0)
Pad_e1920
  round 0.711 hole 0.31x0.305: (0,0)
Pad_e1921
  round 0.711 hole 0.31x0.305: (0,0)
Pad_e1922
  round 0.711 hole 0.31x0.305: (0,0)
Pad_e1923
  round 0.711 hole 0.31x0.305: (0,0)
Pad_e1924
  round 0.711 hole 0.31x0.305: (0,0)
Pad_e1925
  round 0.711 hole 0.31x0.305: (0,0)
Pad_e1926
  round 0.711 hole 0.31x0.305: (0,0)
Pad_e1927
  round 0.711 hole 0.31x0.305: (0,0)
Pad_e1928
  round 0.711 hole 0.31x0.305: (0,0)
Pad_e1929
  round 0.711 hole 0.31x0.305: (0,0)
Pad_e1930
  round 0.711 hole 0.31x0.305: (0,0)
Pad_e1931
  round 0.711 hole 0.31x0.305: (0,0)
Pad_e1932
  round 0.711 hole 0.31x0.305: (0,0)
Pad_e1933
  round 0.711 hole 0.31x0.305: (0,0)
Pad_e1934
  round 0.711 hole 0.31x0.305: (0,0)
Pad_e1935
  round 0.711 hole 0.31x0.305: (0,0)
Pad_e1936
  round 0.711 hole 0.31x0.305: (0,0)
Pad_e1937
  round 0.711 hole 0.31x0.305: (0,0)
Pad_e1938
  round 0.711 hole 0.31x0.305: (0,0)
Pad_e1939
  round 0.711 hole 0.31x0.305: (0,0)
Pad_e1940
  round 0.711 hole 0.31x0.305: (0,0)
Pad_e1941
  round 0.711 hole 0.31x0.305: (0,0)
Pad_e1942
  round 0.711 hole 0.31x0.305: (0,0)
Pad_e1943
  round 0.711 hole 0.31x0.305: (0,0)
Pad_e1944
  round 0.711 hole 0.31x0.305: (0,0)
Pad_e1945
  round 0.711 hole 0.31x0.305: (0,0)
Pad_e1946
  round 0.711 hole 0.31x0.305: (0,0)
Pad_e1947
  round 0.711 hole 0.31x0.305: (0,0)
Pad_e1948
  round 0.711 hole 0.31x0.305: (0,0)
Pad_e1949
  round 0.711 hole 0.31x0.305: (0,0)
Pad_e1950
  round 0.711 hole 0.31x0.305: (0,0)
Pad_e1951
  round 0.711 hole 0.31x0.305: (0,0)
Pad_e1952
  round 0.61 hole 0.31x0.305: (0,0)
Pad_e1953
  round 0.61 hole 0.31x0.305: (0,0)
Pad_e1954
  round 0.61 hole 0.31x0.305: (0,0)
Pad_e1955
  round 0.61 hole 0.31x0.305: (0,0)
Pad_e1956
  round 0.61 hole 0.31x0.305: (0,0)
Pad_e1957
  round 0.61 hole 0.31x0.305: (0,0)
Pad_e1958
  round 0.61 hole 0.31x0.305: (0,0)
Pad_e1959
  round 0.61 hole 0.31x0.305: (0,0)
Pad_e1960
  round 0.61 hole 0.31x0.305: (0,0)
Pad_e1961
  round 0.61 hole 0.31x0.305: (0,0)
Pad_e1962
  round 0.61 hole 0.31x0.305: (0,0)
Pad_e1963
  round 0.61 hole 0.31x0.305: (0,0)
Pad_e1970
  round 0.61 hole 0.31x0.305: (0,0)
Pad_e1971
  round 0.61 hole 0.31x0.305: (0,0)
Pad_e1972
  round 0.61 hole 0.31x0.305: (0,0)
Pad_e1973
  round 0.61 hole 0.31x0.305: (0,0)
Pad_e1974
  round 0.61 hole 0.31x0.305: (0,0)
Pad_e1975
  round 0.61 hole 0.31x0.305: (0,0)
Pad_e1976
  round 0.61 hole 0.31x0.305: (0,0)
Pad_e1977
  round 0.61 hole 0.31x0.305: (0,0)
Pad_e1978
  round 0.61 hole 0.31x0.305: (0,0)
Pad_e1979
  round 0.61 hole 0.31x0.305: (0,0)
Pad_e1980
  round 0.61 hole 0.31x0.305: (0,0)
Pad_e1981
  round 0.61 hole 0.31x0.305: (0,0)
Pad_e1982
  round 0.61 hole 0.31x0.305: (0,0)
Pad_e1983
  round 0.61 hole 0.31x0.305: (0,0)
Pad_e1984
  round 0.61 hole 0.31x0.305: (0,0)
Pad_e1991
  oval 2.54x5.334 hole 1.524x4.318: 2(0,0)
PDFNWB-8L_L6.0-W5.0-P1.27-BL-EP_CON
  rect 3.048x1.321 smd: 1(-0.635,-2.857)
  rect 0.5x1.321 smd: 2(-0.635,-2.857) 3(0.635,-2.857) 4(1.905,-2.857) 6(0.635,2.857) 7(-0.635,2.857)
  rect 4.318x1.321 smd: 5(0,2.857)
  rect 4.318x3.5 smd: 8(0,0.812)
R0603_SMALL
  rect 0.806x0.864 smd: 1(-0.753,0) 2(0.753,0)
R2512
  rect 1.282x3.456 smd: 1(-3.067,0) 2(3.067,0)
SMA_L4.4-W2.8-LS5.4-RD
  rect 1.8x2 smd: 1(-2.1,0) 2(2.1,0)
SMB(DO-214AA)
  rect 2.159x2.743 smd: 1(-2.21,0) 2(2.21,0)
SOD-323_L1.8-W1.3-LS2.5-RD
  rect 1x0.75 smd: 1(-1.173,0) 2(1.173,0)
SOT-23-5_L3.0-W1.7-P0.95-LS2.8-BR
  rect 1x0.6 smd: 1(1.3,-0.95) 2(1.3,0) 3(1.3,0.95) 4(-1.3,0.95) 5(-1.3,-0.95)
SOT-23-6_L2.9-W1.6-P0.95-LS2.8-BR
  rect 1x0.55 smd: 1(1.4,-0.95) 2(1.4,0) 3(1.4,0.95) 4(-1.4,0.95) 5(-1.4,0) 6(-1.4,-0.95)
SOT-25_L3.0-W1.6-P0.95-LS2.8-BL
  rect 0.5x0.899 smd: 1(-0.95,-1.3) 2(0,-1.3) 3(0.95,-1.3) 4(0.95,1.3) 5(-0.95,1.3)
SW-SMD_ST-1185S
  rect 1.15x1.7 smd: 1(-2.175,0) 2(2.175,0)
TESTPOINT 1.6MM
  round 1.2 smd: 1(0,0)
TSSOP-20_L6.5-W4.4-P0.65-LS6.4-BL
  oval 0.364x1.742 smd: 1(-2.925,-2.871) 2(-2.275,-2.871) 3(-1.625,-2.871) 4(-0.975,-2.871) 5(-0.325,-2.871) 6(0.325,-2.871) 7(0.975,-2.871) 8(1.625,-2.871) 9(2.275,-2.871) 10(2.925,-2.871) 11(2.925,2.871) 12(2.275,2.871) 13(1.625,2.871) 14(0.975,2.871) 15(0.325,2.871) 16(-0.325,2.871) 17(-0.975,2.871) 18(-1.625,2.871) 19(-2.275,2.871) 20(-2.925,2.871)
USB-C_SMD-TYPE-C-31-M-12
  oval 1.2x1.8 hole 0.8x1.4: 0(-4.32,-2.624) 1(4.32,-2.624)
  oval 1.2x2 hole 0.8x1.6: 2(4.32,1.556) 3(-4.32,1.556)
  rect 0.3x1.3 smd: A1(-3.35,2.623) A4(-2.55,2.623) A5(-1.25,2.623) A6(-0.25,2.623) A7(0.25,2.623) A8(1.25,2.624) A9(2.55,2.623) A12(3.35,2.623) B1(3.05,2.623) B4(2.25,2.623) B5(1.75,2.623) B6(0.75,2.623) B7(-0.75,2.623) B8(-1.75,2.624) B9(-2.25,2.623) B12(-3.05,2.623)

## Nets
As in the schematic, except:
PGND: C8.1 C21.1 C25.1 C26.1 C28.1 C29.1 D1.2 MC1.1 MC2.1 MC3.1 MC4.1 MC5.1 MC6.1 NOREF#3. NOREF#4. NOREF#5. NOREF#6. NOREF#7. NOREF#8. NOREF#9. NOREF#15. NOREF#17. NOREF#18.2 NOREF#21. NOREF#25. NOREF#29. NOREF#30. NOREF#39. NOREF#41. NOREF#49. NOREF#52. NOREF#55. NOREF#58. NOREF#68. NOREF#69. NOREF#72. NOREF#75. NOREF#77. NOREF#78. NOREF#82. NOREF#85. NOREF#88. NOREF#95. NOREF#98. NOREF#99. NOREF#108. NOREF#109. NOREF#110. NOREF#112. NOREF#113. NOREF#120. NOREF#128. NOREF#129. NOREF#131. NOREF#134. NOREF#135. NOREF#138. NOREF#140. NOREF#144. NOREF#151. NOREF#153. NOREF#157. NOREF#161. NOREF#171. NOREF#176. NOREF#179. NOREF#181. NOREF#182. NOREF#188. NOREF#192. NOREF#203. NOREF#207. NOREF#210. NOREF#211. NOREF#212. NOREF#213. NOREF#218. NOREF#225. NOREF#226. NOREF#228. NOREF#230. NOREF#231. NOREF#233. NOREF#234. NOREF#237. NOREF#238. NOREF#243. NOREF#244. NOREF#246. NOREF#247. NOREF#249. NOREF#250. NOREF#251. NOREF#260. NOREF#264. R2.1 R3.1 R14.1 R61.1 U4.3 U8.3 U9.3
DCBUS: C8.2 C21.2 C25.2 C26.2 C27.2 C28.2 C29.2 D1.1 MC1.2 MC2.2 MC3.2 MC4.2 MC5.2 MC6.2 NOREF#12. NOREF#16. NOREF#26. NOREF#32. NOREF#34. NOREF#35. NOREF#43. NOREF#45. NOREF#46. NOREF#47. NOREF#50. NOREF#54. NOREF#56. NOREF#57. NOREF#59. NOREF#60. NOREF#66. NOREF#67. NOREF#76. NOREF#81. NOREF#87. NOREF#89. NOREF#91. NOREF#102. NOREF#104. NOREF#107. NOREF#115. NOREF#122. NOREF#133. NOREF#136. NOREF#137. NOREF#139. NOREF#141. NOREF#145. NOREF#147. NOREF#154. NOREF#155. NOREF#158. NOREF#159. NOREF#160. NOREF#165. NOREF#166. NOREF#174. NOREF#183. NOREF#185. NOREF#187. NOREF#191. NOREF#195. NOREF#198. NOREF#204. NOREF#208. NOREF#215. NOREF#217. NOREF#219. NOREF#224. NOREF#232. NOREF#242. NOREF#245.2 NOREF#248. NOREF#252. NOREF#255. NOREF#261. NOREF#265. NOREF#267. Q7.5 Q7.6 Q7.7 Q7.8 Q8.5 Q8.6 Q8.7 Q8.8 Q9.5 Q9.6 Q9.7 Q9.8 R1.1 R29.1 U2.5
M0_SH_A: C3.1 H1.3 NOREF. NOREF#33. NOREF#38. NOREF#40. NOREF#48. NOREF#53. NOREF#61. NOREF#62. NOREF#64. NOREF#71. NOREF#84. NOREF#94. NOREF#96. NOREF#103. NOREF#106. NOREF#116. NOREF#117. NOREF#121. NOREF#126. NOREF#130. NOREF#143. NOREF#149. NOREF#150. NOREF#156. NOREF#168. NOREF#173. NOREF#178. NOREF#190. NOREF#196. NOREF#199. NOREF#201. NOREF#202. NOREF#206. NOREF#209. NOREF#235. NOREF#239. NOREF#240. NOREF#259. NOREF#263. Q7.1 Q7.2 Q7.3 Q10.5 Q10.6 Q10.7 Q10.8 U1.12
M0_SH_B: C12.1 H1.2 NOREF#10. NOREF#13. NOREF#14. NOREF#20. NOREF#28. NOREF#31. NOREF#42. NOREF#73. NOREF#74. NOREF#79. NOREF#80. NOREF#83. NOREF#86. NOREF#90. NOREF#92. NOREF#93. NOREF#100. NOREF#101. NOREF#105. NOREF#114. NOREF#118. NOREF#124. NOREF#132. NOREF#142. NOREF#146. NOREF#152. NOREF#169. NOREF#172. NOREF#177. NOREF#180. NOREF#184. NOREF#189. NOREF#205. NOREF#227. NOREF#254. NOREF#256. NOREF#257. NOREF#262. NOREF#266. Q8.1 Q8.2 Q8.3 Q11.5 Q11.6 Q11.7 Q11.8 U1.15
M0_SH_C: C11.1 H1.1 NOREF#11. NOREF#19. NOREF#22. NOREF#23. NOREF#24. NOREF#27. NOREF#36. NOREF#37. NOREF#44. NOREF#51. NOREF#63. NOREF#65. NOREF#70. NOREF#97. NOREF#111. NOREF#119. NOREF#123. NOREF#125. NOREF#127. NOREF#162. NOREF#164. NOREF#167. NOREF#170. NOREF#175. NOREF#186. NOREF#193. NOREF#194. NOREF#197. NOREF#200. NOREF#214. NOREF#216. NOREF#220. NOREF#221. NOREF#222. NOREF#223. NOREF#229. NOREF#236. NOREF#241. NOREF#258. Q9.1 Q9.2 Q9.3 Q12.5 Q12.6 Q12.7 Q12.8 U1.18

Pads without a net: CN5 0 7; CN6 3 4; LED4 1; NOREF#2 1; NOREF#148 1; NOREF#163 1; NOREF#253 1; U3 2 3 6 25 38 39 40 43 45 46; U6 5; U7 4; U13 4; U14 6; USBC1 1 2 3 A5 A8 B5 B8; X1 1

## Via types
v1: diameter 0.508, hole 0.305, Top Layer to Bottom Layer, 130 vias
v2: diameter 0.61, hole 0.305, Top Layer to Bottom Layer, 2 vias

## Routing (per net, layer and track width the routed paths; a pad name or vN(x,y) marks a point on that pad's centre or on a via; arc(x,y) is an arc through that point)
5V: length 86.1
  Top Layer w0.152: U13.1 43.39,17.6 42.95,17.15 41.93,17.15 41.49,17.6 U13.3 ; U7.3 43.39,23.44 43.01,23.82 41.87,23.82 41.49,23.44 41.49,22.84 ; TP2.1 28.53,7.76 D4.1
  Top Layer w0.254: C5.2 48.28,17.85 v1(47.39,18.74) 48.28,19.63 C20.2 ; v1(45.04,6.68) 45.04,6.61 45.75,5.91 C10.1 46.05,4.1 LED4.4 ; v1(40.35,18.36) 40.37,18.34 U13.3 41.49,19.68 C31.2 C89.2 41.49,21.55 U7.1 ; 9.38,5.19 9.42,5.15 v1(9.42,3.56)
  Top Layer w0.305: D4.1 v1(30.57,6.23)
  Inner2 w0.254: v1(40.35,18.36) 40.73,18.74 v1(47.39,18.74) ; v1(9.42,3.56) 13.23,3.56 14.18,4.52 28.85,4.52 v1(30.57,6.23)
  Inner2 w0.305: 40.35,7.57 31.9,7.57 v1(30.57,6.23) ; 40.35,7.57 41.24,6.68 v1(45.04,6.68) ; 40.35,7.57 v1(40.35,18.36)
AVCC: length 63.4
  Top Layer w0.152: 26.31,26.94 26.57,26.94 v1(27.52,27.89) ; U3.9 14.9,23.29 14.56,23.63 12.4,23.63 11.89,23.12 11.89,24.27 11.07,25.09 9.36,25.09 8.6,25.85 8.59,26.94 8.92,26.94 v1(9.8,27.82) ; 43.19,14.3 43.39,14.49 U13.5 ; v1(33.11,27.89) 32.16,26.94 31.96,26.94
  Top Layer w0.203: v1(43.2,13.34) 43.2,14.29 C30.2
  Top Layer w0.254: v1(38,26.11) 37.99,27.12
  Bottom Layer w0.254: v1(9.8,27.82) 9.87,27.89 v1(27.52,27.89) v1(33.11,27.89) 36.22,27.89 v1(38,26.11) 39.46,26.11 43.2,22.36 v1(43.2,13.34)
GND: length 37.4
  Top Layer w0.152: v1(3.83,28.58) 3.83,45.35 4.98,46.49 6.63,46.49 9.4,49.26 9.4,50.51 ; 38.95,14.8 38.95,14.93 37.65,16.23 U1.8 37.68,17.23 v1(37.68,18.77) ; C14.1 36.58,10.68 U6.2 ; 34.25,27.89 34.06,27.89 32.54,26.36 30.82,26.36 ; R61.2 51.61,28.22 v1(50.81,28.22) ; 4.42,17.47 v1(3.64,16.71)
  vias: v1(5.55,28.77) v1(5.71,7.46) v1(6.02,7.99) v1(6.02,6.93) v1(6.16,28.77) v1(6.32,7.46) v1(6.63,7.99) v1(6.63,6.93) v1(6.77,28.77) v1(6.93,7.46) v1(15.37,9.49) v1(15.67,10.02) v1(15.67,8.96) v1(15.97,9.49) v1(16.28,10.02) v1(16.28,8.96) v1(16.58,9.49) v1(30.69,26.93) v1(37.15,19.68) v1(37.15,19.07) v1(37.68,19.38) v1(39.01,28.52) v1(46.15,28.15) v1(46.45,28.67) v1(46.45,27.62) v1(46.76,28.15) v1(47.06,28.67) v1(47.06,27.62) v1(47.37,28.15) v1(48.25,1.03) v1(48.55,1.55) v1(48.85,1.03) v1(49.59,28.22) v1(49.9,28.75) v1(49.9,27.69) v1(50.2,28.22) v1(50.51,28.75) v1(50.51,27.69) v1(52.64,7.14) v1(52.94,7.67) v1(52.94,6.61) v1(53.25,7.14) v1(53.55,7.67) v1(53.55,6.61) v1(53.86,7.14)
PGND: length 37.3
  Top Layer w0.152: 12.15,30.68 12.15,33.56 11.9,33.8 10.38,33.8 9.87,33.29 9.87,29.73 10.76,28.84 10.89,28.84 ; 34.25,28.84 33.36,29.73 33.36,32.81 34.26,33.71 35.79,33.72 36.04,33.47 36.04,30.59 ; 28.6,28.84 27.69,29.75 27.69,33.23 28.29,33.84 29.82,33.84 30.07,33.59 30.07,30.72
  Top Layer w0.254: 53.62,30.36 53.49,30.36 53.49,28.59 R61.1
  Bottom Layer w0.254: 6.1,32.03 6.1,35.89
VCC: length 83.8
  Top Layer w0.152: v1(33.11,3.5) 33.13,3.53 CN4.1 ; v1(5.61,9.66) 5.61,11.55 5.63,11.57 ; RT1.2 45.3,48.27 43.84,49.73 43.17,49.73 43.13,49.77 ; U3.24 C1.2 v1(11.07,12.26) ; C19.2 13.94,26.11 X1.4 15.14,26.13 v1(15.14,27.06) ; U3.36 19.65,13.86 C17.2 ; 20.41,13.09 v1(20.41,12.2) ; 45.3,45.26 45.51,45.26 46,44.78 46,30.17 43.84,28.01 42.12,28.01 41.69,27.58 C90.2 ; U6.3 36.58,10.03 C14.2 36.15,9.6 v1(35.2,9.6) ; v1(54.38,17.15) 53.67,16.45 R6.1 ; TP1.1 32.15,10.23 v1(32.79,9.6) ; v1(0.91,23.44) 0.91,22.88 R4.1 ; 20.4,20.86 v1(20.41,22.04) 20.41,23.12 19.67,23.12 U3.1 ; v1(4.34,28.08) 4.34,45.28 5.17,46.11 6.88,46.11 9.74,48.97 13.74,48.97 14.4,49.63 14.4,50.51
  Top Layer w0.254: 41.49,25.31 41.49,26.74 C90.2
  Top Layer w0.305: 40.85,26.93 v1(40.84,26.93) ; 40.85,26.93 v1(40.85,26.04) ; 40.85,26.93 C90.2
(no net): length 1.9
  Top Layer w0.152: U3.2 v1(18.4,20.84)
  Inner2 w0.152: 19.52,18.36 19.13,18.36
_USB_DM: length 4.7
  Top Layer w0.152: 20.78,7.9 20.78,8.71 20.53,8.96 20.09,8.96 19.84,8.71 19.84,7.95 USBC1.B7 R63.2
_USB_DP: length 4.8
  Top Layer w0.152: R62.2 21.28,7.11 20.98,6.8 20.53,6.8 20.28,7.06 USBC1.A6
BOOT0: length 22.2
  Top Layer w0.152: v1(18.57,18.87) 20.39,18.87 U3.44 ; 1.28,11.57 1.81,11.57 R10.1 ; 4.42,14.17 v1(5.17,14.93)
  Inner2 w0.152: v1(5.17,14.93) 8.47,18.23 14.95,18.23 15.58,18.87 v1(18.57,18.87)
CAN_H: length 8.1
  Top Layer w0.152: U6.7 41.54,10.68 43.33,8.9 43.32,8.39
  Top Layer w0.203: v1(43.32,8.39) 42.5,7.57 42.5,4.74
CAN_L: length 6.4
  Top Layer w0.152: v1(41.82,8.39) 41.8,9.73 41.5,10.03 U6.6
  Top Layer w0.203: 41.3,5.04 41.3,7.87 v1(41.82,8.39)
CAN_RX: length 24.4
  Top Layer w0.152: U6.4 v1(37.62,8.52) ; U3.41 v1(21.8,17.34)
  Bottom Layer w0.152: v1(37.62,8.52) 26.12,8.52 21.8,12.84 v1(21.8,17.34)
CAN_TX: length 21.9
  Top Layer w0.152: v1(37.55,12.2) 37.55,11.38 37.6,11.33 ; 20.4,17.86 v1(22.5,17.85)
  Bottom Layer w0.152: v1(22.5,17.85) 22.5,15.31 25.61,12.2 v1(37.55,12.2)
CUR_A: length 35.9
  Top Layer w0.152: 4.41,19.12 v1(5.23,18.3) ; 34.25,26.94 v1(35.33,26.93)
  Inner2 w0.152: v1(5.23,18.3) 12.41,25.47 33.87,25.47 v1(35.33,26.93)
CUR_B: length 33.3
  Top Layer w0.152: v1(2.18,18.3) 2.18,18.36 1.36,19.19 ; 28.6,26.94 v1(29.61,26.93)
  Inner2 w0.152: v1(29.61,26.93) 28.73,26.04 12.03,26.04 4.28,18.3 v1(2.18,18.3)
CUR_C: length 10.4
  Top Layer w0.152: 4.41,22.42 v1(5.23,23.25) ; 10.89,26.94 v1(11.9,26.93)
  Inner2 w0.152: v1(5.23,23.25) 8.22,23.25 v1(11.9,26.93)
DCBUS: length 42.8
  Top Layer w0.152: R1.1 v1(1.36,15.82)
  Top Layer w0.305: 50.76,38.05 49.62,36.9 49.62,30.3 48.28,28.97 C27.2
  Bottom Layer w0.152: 5.99,40.74 1.36,40.71 0.4,39.76 0.4,16.77 v1(1.36,15.82)
M0_GH_A: length 10.7
  Top Layer w0.152: 37.65,22.94 37.65,24.69 38.95,25.98 38.95,27.5 40.47,29.03 42.12,29.03 42.89,29.79 42.89,30.56
M0_GH_B: length 18.3
  Top Layer w0.152: 35.7,22.94 35.7,23.96 34.57,25.09 24.92,25.09 23.46,26.55 23.46,30.56
M0_GH_C: length 19.3
  Top Layer w0.152: 19.01,30.56 19.01,29.16 23.84,24.33 33.42,24.33 33.75,24 33.75,22.94
M0_GL_A: length 14.6
  Top Layer w0.152: R11.1 v1(41.3,29.6) ; U1.9 38.3,19.11 40.03,20.84 40.03,26.87 v1(41.3,28.14)
  Inner2 w0.152: v1(41.3,29.6) v1(41.3,28.14)
M0_GL_B: length 25.1
  Top Layer w0.152: 24.98,30.56 24.98,26.81 25.87,25.92 36.03,25.92 v1(36.98,24.96) ; 38.95,17.2 v1(38.95,18.61)
  Inner2 w0.152: v1(36.98,24.96) 38.95,23 v1(38.95,18.61)
M0_GL_C: length 26.4
  Top Layer w0.152: v1(31.96,23.82) 23.58,23.82 17.49,29.92 17.49,30.56 ; v1(38.95,24.46) 38.95,22.95 U1.11
  Bottom Layer w0.152: v1(38.95,24.46) 38.31,23.82 v1(31.96,23.82)
M0_SH_A: length 37.5
  Top Layer w0.152: 31.01,18.07 31.87,18.07 32.47,18.68 35.14,18.68 38.3,21.84 38.3,24.7 39.33,25.73 39.33,27.38 40.6,28.65 42.5,28.65 44.66,30.81 44.66,44.4 43.65,45.41 Q7.1
M0_SH_B: length 42.2
  Top Layer w0.152: 31.01,20.14 35.14,20.14 36.35,21.35 36.35,24.26 35.14,25.47 25.55,25.47 24.22,26.81 24.22,33.41 24.66,33.85 26.38,33.85 26.76,34.24 26.76,40.39 29.73,43.37 30.19,43.37
M0_SH_C: length 39.9
  Top Layer w0.152: 18.88,45.41 19.84,45.41 21.23,44.01 21.23,27.89 24.41,24.71 34,24.71 34.4,24.3 34.4,22.94 ; U1.18 34.4,22.01 33.87,21.47 31.74,21.47 31.01,22.2
M0_SN_A: length 10.9
  Top Layer w0.152: 36.03,37.03 36.04,34.35 35.79,34.09 34.14,34.09 32.92,32.87 32.92,29.79 31.96,28.84
M0_SN_B: length 10.8
  Top Layer w0.152: 30.06,37.16 30.07,34.47 29.82,34.22 28.17,34.22 27.22,33.28 27.22,29.75 26.31,28.84
M0_SN_C: length 10.7
  Top Layer w0.152: 12.14,37.12 12.15,34.44 11.9,34.18 10.25,34.18 9.48,33.42 9.48,29.73 8.59,28.84
M0_VB_A: length 12.6
  Top Layer w0.152: U1.14 37,21.43 34.69,19.12 30.66,19.12 29.61,18.07 27.33,18.07 D5.1
M0_VB_B: length 9.6
  Top Layer w0.152: D2.1 27.33,20.14 29.61,20.14 30.5,21.03 34.25,21.03 35.05,21.83 35.05,22.94
M0_VB_C: length 7
  Top Layer w0.152: 33.1,23.38 33.1,23.31 ; 33.1,23.31 30.19,23.31 29.61,22.74 29.61,22.2 27.33,22.2 D3.1 ; 33.1,23.31 33.1,22.94
NRST: length 22.8
  Top Layer w0.152: 2.87,22.42 2.87,23.69 4.6,25.41 5.8,25.41 ; U3.7 15.9,22.36 v2(15.9,23.82) ; 5.8,25.41 5.8,25.04 5.82,25.03 5.82,25.41 5.8,25.41 ; 5.8,25.41 v1(5.8,26.93) ; R4.2 C13.2
  Bottom Layer w0.152: v1(5.8,26.93) 5.8,25.16 7.14,23.82 v2(15.9,23.82)
PWMA_H: length 22.3
  Top Layer w0.152: U1.3 34.4,15.21 v1(34.38,15.19) ; v1(15.39,15.25) 15.39,13.95 15.39,13.94
  Inner2 w0.152: v1(34.38,15.19) 15.45,15.19 v1(15.39,15.25)
PWMA_L: length 29.5
  Top Layer w0.152: U3.26 13.9,11.41 v1(13.87,11.38) ; v1(36.35,13.53) U1.6
  Inner2 w0.152: v1(13.87,11.38) 15.14,11.38 17.3,13.53 v1(36.35,13.53)
PWMB_H: length 21.2
  Top Layer w0.152: 15.9,13.86 15.9,13.86 v1(15.9,15.76) ; v1(33.74,15.76) U1.2
  Inner2 w0.152: v1(15.9,15.76) v1(33.74,15.76)
PWMB_L: length 27.3
  Top Layer w0.152: v1(35.71,14.04) U1.5 ; 14.4,14.05 14.4,12.11 14.44,12.07
  Inner2 w0.152: v1(35.71,14.04) 17.36,14.04 17.04,13.72 16.98,13.72 15.14,11.88 v1(14.44,11.88)
PWMC_H: length 19.6
  Top Layer w0.152: U1.1 33.1,17.02 v1(32.34,16.27) ; U3.31 16.41,13.86 v1(16.41,16.27)
  Inner2 w0.152: v1(16.41,16.27) v1(32.34,16.27)
PWMC_L: length 25.1
  Top Layer w0.152: 14.95,12.52 14.9,12.56 14.9,14.05 ; U1.4 35.05,14.66 v1(35.01,14.61)
  Inner2 w0.152: v1(35.01,14.61) 17.17,14.61 v1(14.95,12.39)
REF: length 32.8
  Top Layer w0.152: 36.48,28.46 36.23,28.71 v1(35.46,28.71) ; 8.59,27.89 8.91,27.89 v1(9.8,28.77) ; v1(33.14,28.71) 32.32,27.89 31.96,27.89 ; v1(27.52,28.71) 26.69,27.89 26.31,27.89 ; 36.48,28.46 36.48,27.12
  Bottom Layer w0.254: v1(9.8,28.77) 27.46,28.77 v1(27.52,28.71) v1(33.14,28.71) v1(35.46,28.71)
RGB: length 55.7
  Top Layer w0.152: 47.4,3.18 47.71,3.18 48.09,3.56 48.09,5.66 v1(47.78,5.98) ; U3.10 14.4,21.13 v1(15.2,20.33)
  Bottom Layer w0.152: v1(47.78,5.98) 47.71,5.98 46.89,5.15 14.56,5.15 13.36,6.36 13.36,16.46 15.2,18.3 v1(15.2,20.33)
SPI1_CS_1: length 51.1
  Top Layer w0.152: 10.4,50.51 10.4,51.36 10.06,51.7 8.6,51.7 7.9,51 7.9,48.33 6.44,46.87 4.66,46.87 3.33,45.54 v1(3.33,29.09) ; U3.4 v1(17.4,20.84)
  Bottom Layer w0.152: v1(3.33,29.09) 3.33,23.12 5.61,20.84 v1(17.4,20.84)
SPI1_CS_2: length 38.6
  Top Layer w0.152: v1(1.17,31.12) TP4.1 ; v2(10.5,17.28) 11.83,17.28 U3.20
  Bottom Layer w0.152: v2(10.5,17.28) 4.98,17.28 1.42,20.84 1.42,29.79 1.17,30.04 v1(1.17,31.12)
SPI1_MISO: length 53.9
  Top Layer w0.152: U3.16 11.92,19.38 v1(13.74,19.38) ; 12.4,50.51 12.4,51.39 11.45,52.33 7.96,52.33 7.14,51.51 7.14,48.71 6.06,47.63 4.09,47.63 2.25,45.79 v1(2.25,30.11)
  Bottom Layer w0.152: v1(2.25,30.11) 2.25,22.11 4.98,19.38 v1(13.74,19.38)
SPI1_MOSI: length 55.6
  Top Layer w0.152: 13.4,50.51 13.4,51.15 11.83,52.71 7.77,52.71 6.69,51.63 6.69,48.97 5.74,48.02 3.9,48.02 1.74,45.86 v1(1.74,30.62) ; U3.17 11.95,18.81 v1(13.23,18.81)
  Bottom Layer w0.152: v1(1.74,30.62) 1.74,21.6 4.53,18.81 v1(13.23,18.81)
SPI1_SCK: length 49.9
  Top Layer w0.152: U3.15 11.93,19.88 v1(13.23,19.88) ; 11.4,50.51 11.4,51.25 10.63,52.02 8.28,52.02 7.52,51.25 7.52,48.52 6.25,47.25 4.34,47.25 2.75,45.67 v1(2.75,29.6)
  Bottom Layer w0.152: v1(13.23,19.88) 5.48,19.88 2.75,22.61 v1(2.75,29.6)
